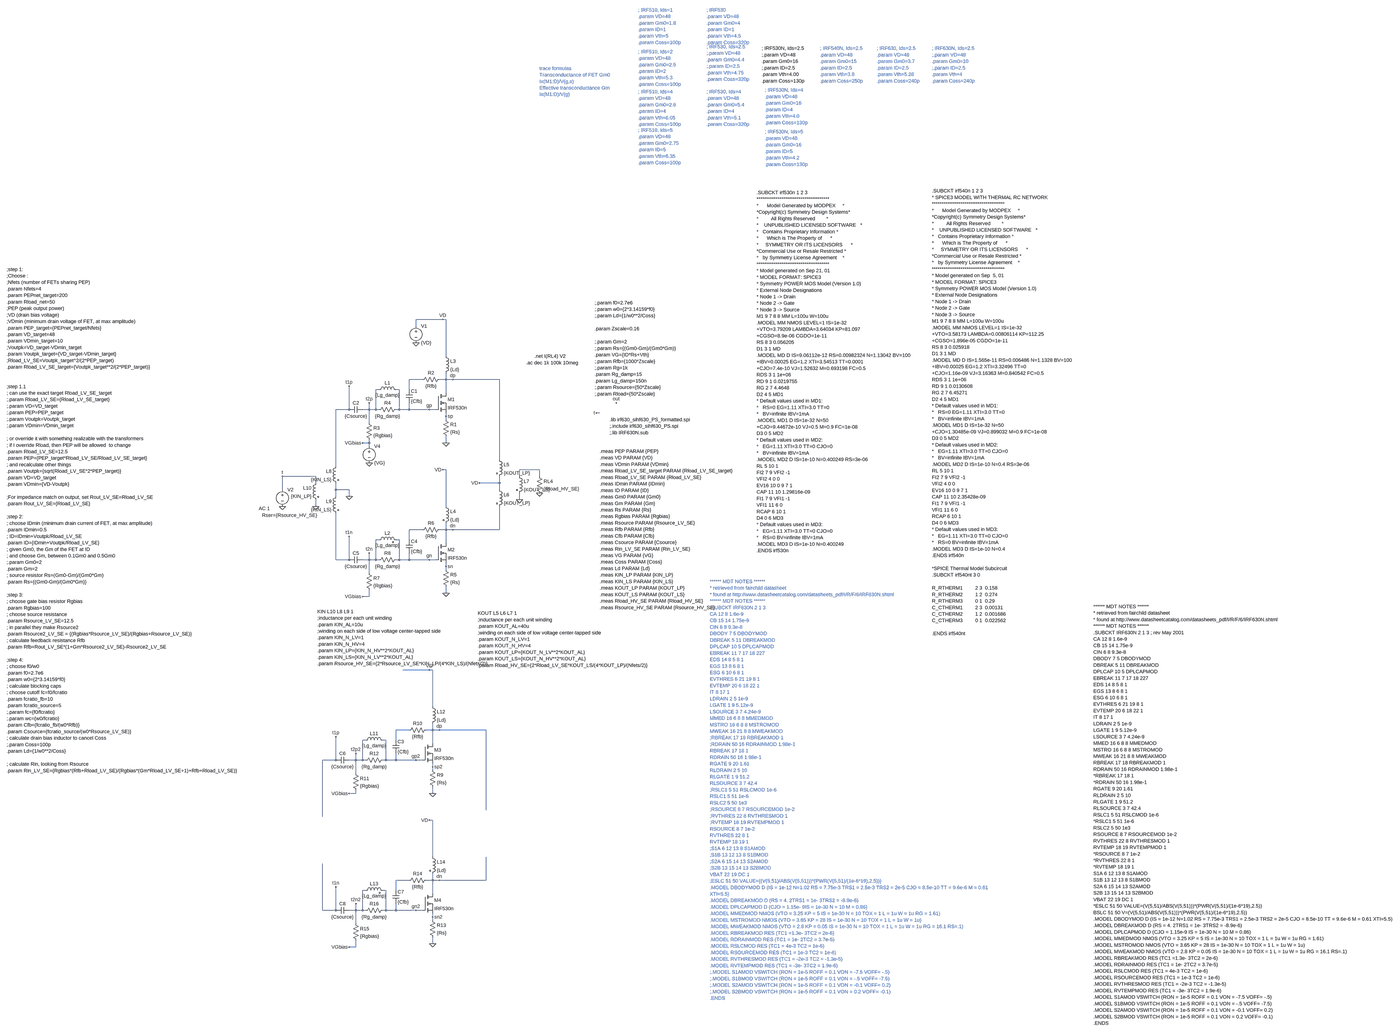
[diagram p0: schematic RFPA_pushpullx2_smallsignal_param.asc, whole sheet]
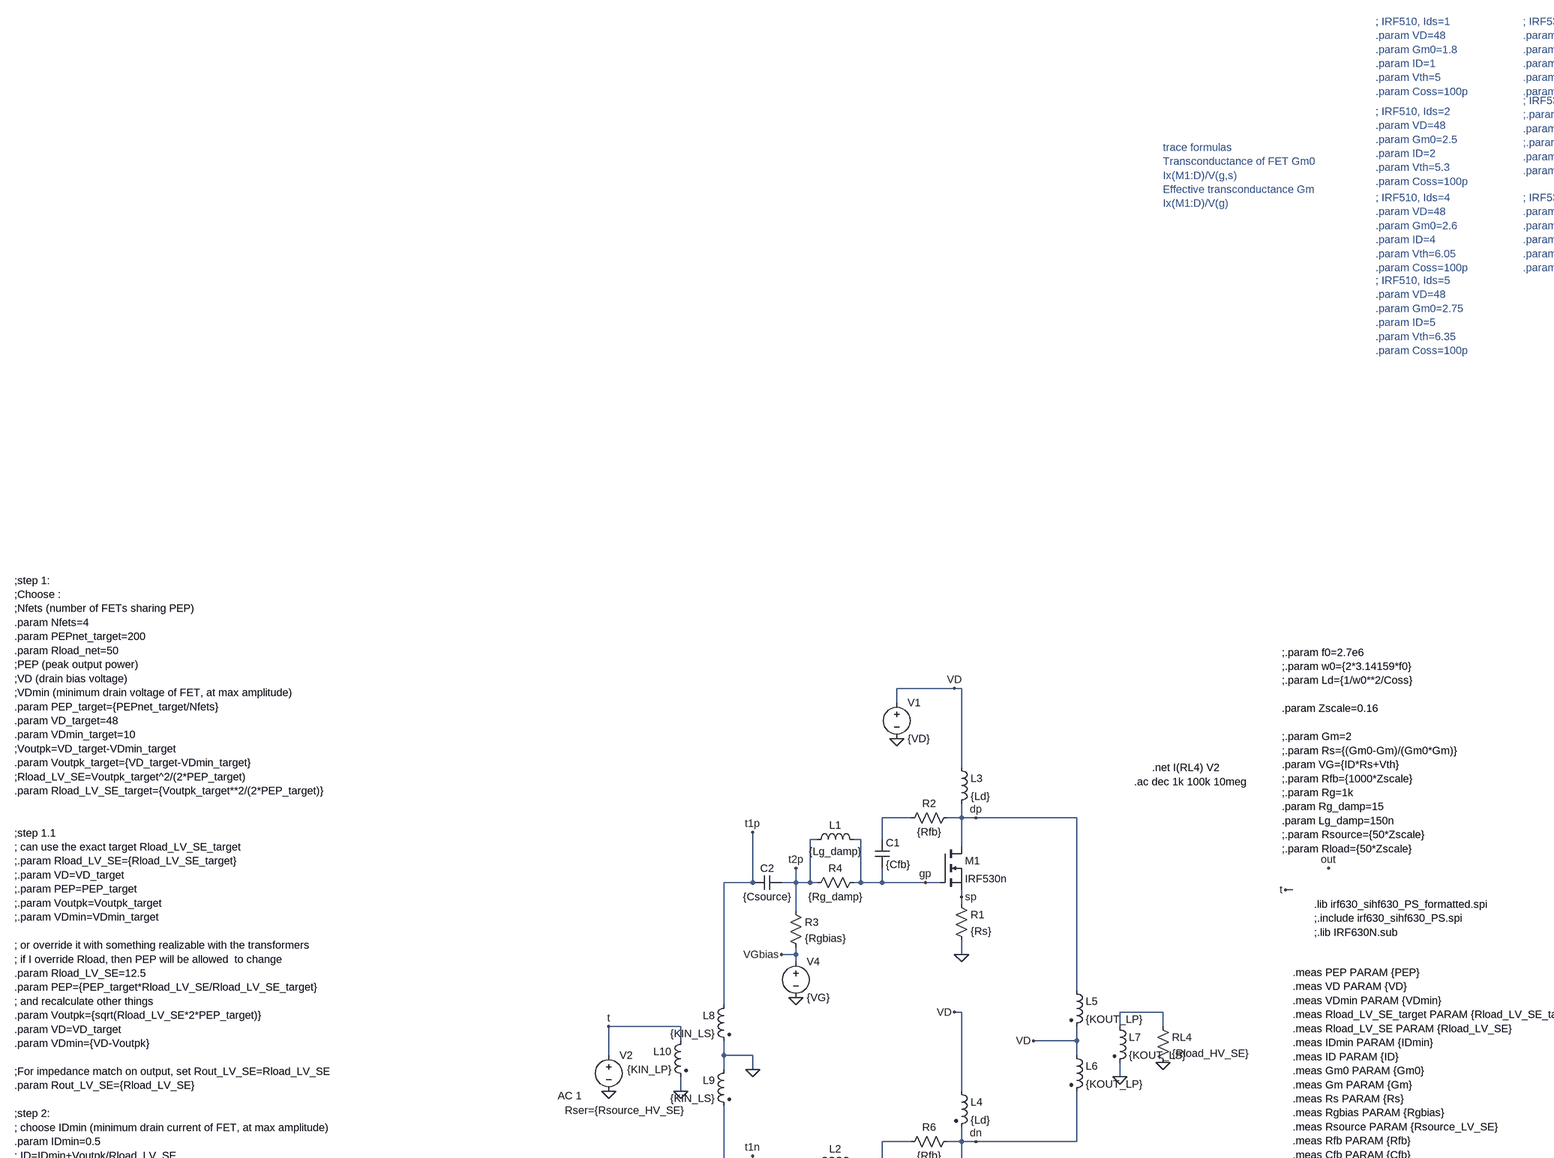
[diagram p1: schematic RFPA_pushpullx2_smallsignal_param.asc, part, row 1 of 2, column 1 of 2]
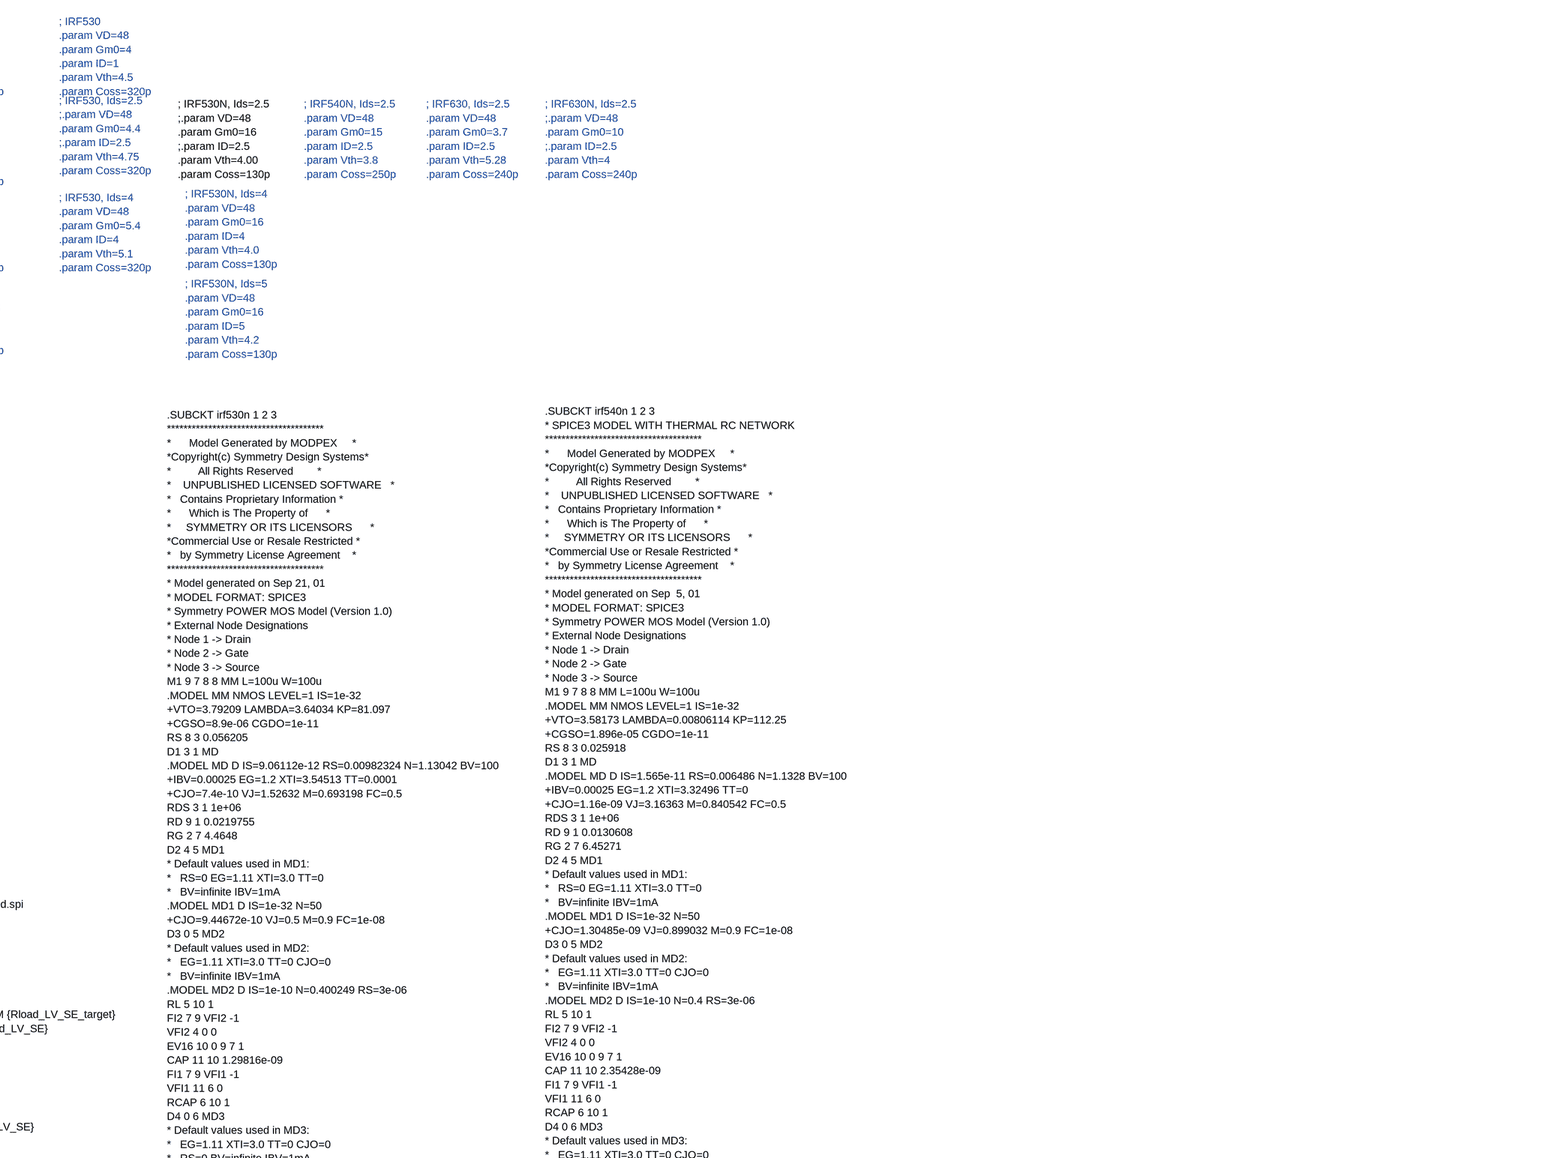
[diagram p2: schematic RFPA_pushpullx2_smallsignal_param.asc, part, row 1 of 2, column 2 of 2]
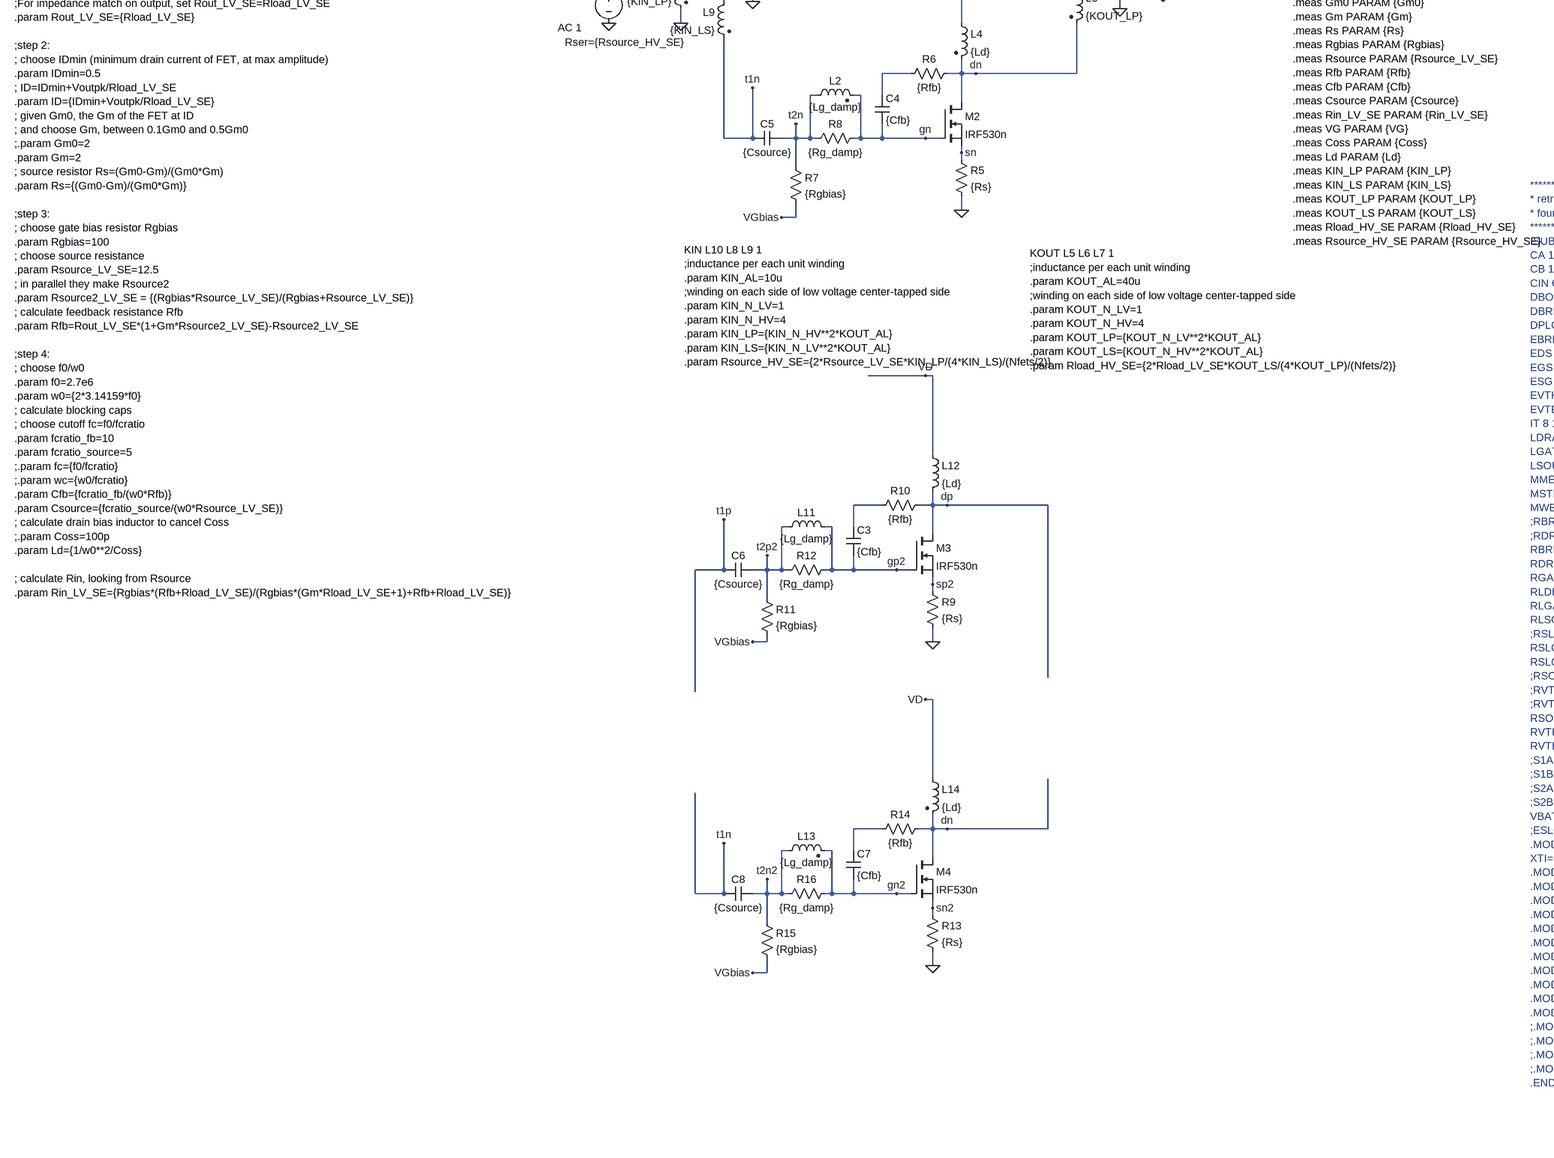
[diagram p3: schematic RFPA_pushpullx2_smallsignal_param.asc, part, row 2 of 2, column 1 of 2]
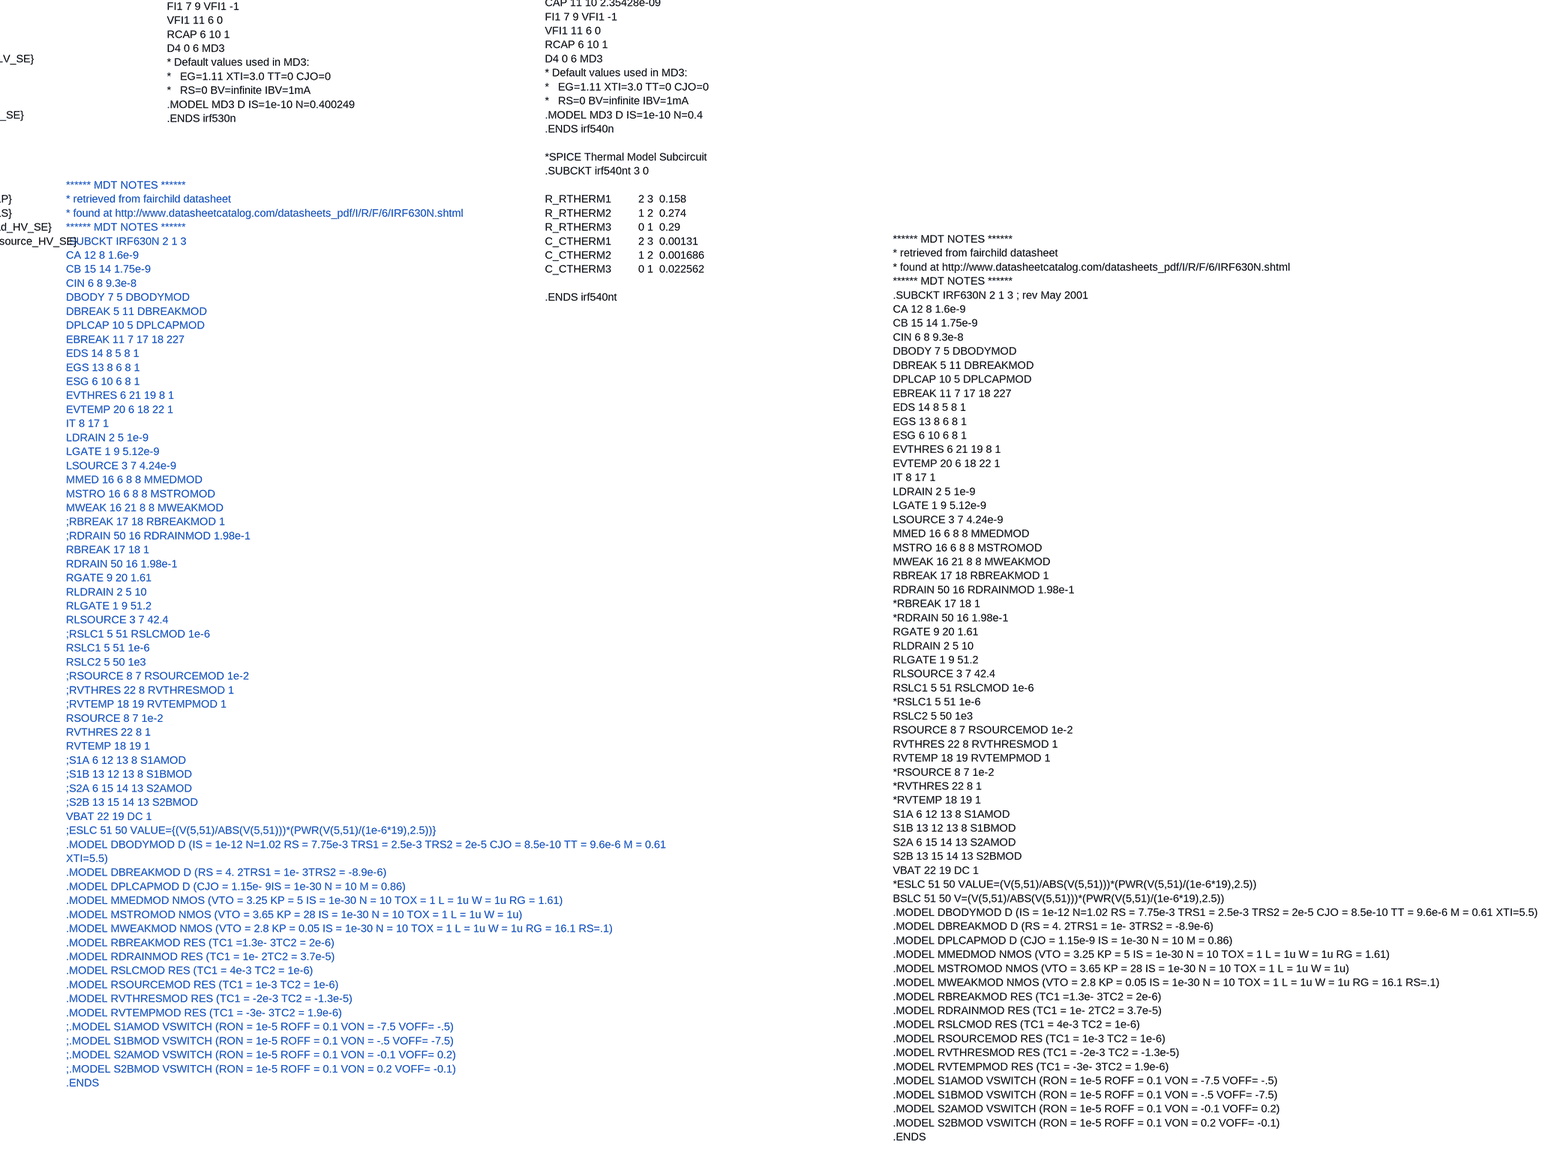
[diagram p4: schematic RFPA_pushpullx2_smallsignal_param.asc, part, row 2 of 2, column 2 of 2]
RFPA_pushpullx2_smallsignal_param.asc, the LTspice schematic file:
Version 4
SHEET 1 5344 3112
WIRE 176 -368 48 -368
WIRE 192 -368 176 -368
WIRE 48 -336 48 -368
WIRE 192 -192 192 -368
WIRE 80 -80 16 -80
WIRE 192 -80 192 -112
WIRE 192 -80 160 -80
WIRE 224 -80 192 -80
WIRE 448 -80 224 -80
WIRE -128 -32 -144 -32
WIRE -32 -32 -48 -32
WIRE 16 -32 16 -80
WIRE 192 -16 192 -80
WIRE -272 64 -272 -48
WIRE -272 64 -336 64
WIRE -176 64 -176 32
WIRE -176 64 -208 64
WIRE -144 64 -144 -32
WIRE -144 64 -176 64
WIRE -128 64 -144 64
WIRE -32 64 -32 -32
WIRE -32 64 -48 64
WIRE 16 64 16 32
WIRE 16 64 -32 64
WIRE 112 64 16 64
WIRE 144 64 112 64
WIRE 928 80 912 80
WIRE 192 96 192 80
WIRE 192 112 192 96
WIRE -176 128 -176 64
WIRE -176 224 -176 208
WIRE -176 224 -208 224
WIRE 192 224 192 192
WIRE -176 240 -176 224
WIRE 448 304 448 -80
WIRE -336 336 -336 64
WIRE 192 352 176 352
WIRE 640 352 544 352
WIRE -432 384 -592 384
WIRE 544 384 544 352
WIRE 640 384 640 352
WIRE -432 416 -432 384
WIRE 448 416 448 384
WIRE 448 416 352 416
WIRE -592 448 -592 384
WIRE -336 448 -336 416
WIRE -272 448 -336 448
WIRE 448 448 448 416
WIRE -336 480 -336 448
WIRE -272 480 -272 448
WIRE 544 496 544 464
WIRE -432 528 -432 496
WIRE 192 528 192 352
WIRE 80 640 16 640
WIRE 192 640 192 608
WIRE 192 640 160 640
WIRE 224 640 192 640
WIRE 448 640 448 528
WIRE 448 640 224 640
WIRE -128 688 -144 688
WIRE -32 688 -48 688
WIRE 16 688 16 640
WIRE 192 704 192 640
WIRE -336 784 -336 560
WIRE -272 784 -272 672
WIRE -272 784 -336 784
WIRE -176 784 -176 752
WIRE -176 784 -208 784
WIRE -144 784 -144 688
WIRE -144 784 -176 784
WIRE -128 784 -144 784
WIRE -32 784 -32 688
WIRE -32 784 -48 784
WIRE 16 784 16 752
WIRE 16 784 -32 784
WIRE 112 784 16 784
WIRE 144 784 112 784
WIRE 192 816 192 800
WIRE 192 832 192 816
WIRE -176 848 -176 784
WIRE 192 944 192 912
WIRE -176 960 -176 928
WIRE -176 960 -208 960
WIRE 112 1312 -16 1312
WIRE 128 1312 112 1312
WIRE 128 1488 128 1312
WIRE 16 1600 -48 1600
WIRE 128 1600 128 1568
WIRE 128 1600 96 1600
WIRE 160 1600 128 1600
WIRE 384 1600 160 1600
WIRE -192 1648 -208 1648
WIRE -96 1648 -112 1648
WIRE -48 1648 -48 1600
WIRE 128 1664 128 1600
WIRE -336 1744 -336 1632
WIRE -336 1744 -400 1744
WIRE -240 1744 -240 1712
WIRE -240 1744 -272 1744
WIRE -208 1744 -208 1648
WIRE -208 1744 -240 1744
WIRE -192 1744 -208 1744
WIRE -96 1744 -96 1648
WIRE -96 1744 -112 1744
WIRE -48 1744 -48 1712
WIRE -48 1744 -96 1744
WIRE 48 1744 -48 1744
WIRE 80 1744 48 1744
WIRE 128 1776 128 1760
WIRE 128 1792 128 1776
WIRE -240 1808 -240 1744
WIRE -240 1904 -240 1888
WIRE -240 1904 -272 1904
WIRE 128 1904 128 1872
WIRE 384 1984 384 1600
WIRE -400 2016 -400 1744
WIRE 128 2032 112 2032
WIRE 128 2208 128 2032
WIRE 16 2320 -48 2320
WIRE 128 2320 128 2288
WIRE 128 2320 96 2320
WIRE 160 2320 128 2320
WIRE 384 2320 384 2208
WIRE 384 2320 160 2320
WIRE -192 2368 -208 2368
WIRE -96 2368 -112 2368
WIRE -48 2368 -48 2320
WIRE 128 2384 128 2320
WIRE -400 2464 -400 2240
WIRE -336 2464 -336 2352
WIRE -336 2464 -400 2464
WIRE -240 2464 -240 2432
WIRE -240 2464 -272 2464
WIRE -208 2464 -208 2368
WIRE -208 2464 -240 2464
WIRE -192 2464 -208 2464
WIRE -96 2464 -96 2368
WIRE -96 2464 -112 2464
WIRE -48 2464 -48 2432
WIRE -48 2464 -96 2464
WIRE 48 2464 -48 2464
WIRE 80 2464 48 2464
WIRE 128 2496 128 2480
WIRE 128 2512 128 2496
WIRE -240 2528 -240 2464
WIRE 128 2624 128 2592
WIRE -240 2640 -240 2608
WIRE -240 2640 -272 2640
FLAG 192 224 0
FLAG -592 528 0
FLAG -176 320 0
FLAG 48 -256 0
FLAG 224 -80 dp
FLAG 112 64 gp
FLAG 192 96 sp
FLAG -592 384 t
FLAG 1008 32 out
FLAG -272 -48 t1p
FLAG 912 80 t
FLAG -176 32 t2p
FLAG 192 944 0
FLAG 224 640 dn
FLAG 112 784 gn
FLAG 192 816 sn
FLAG -272 672 t1n
FLAG -176 752 t2n
FLAG 176 -368 VD
FLAG 176 352 VD
FLAG -208 224 VGbias
FLAG -208 960 VGbias
FLAG 640 464 0
FLAG 544 496 0
FLAG -432 528 0
FLAG -272 480 0
FLAG 352 416 VD
FLAG 128 1904 0
FLAG 160 1600 dp
FLAG 48 1744 gp2
FLAG 128 1776 sp2
FLAG -336 1632 t1p
FLAG -240 1712 t2p2
FLAG 128 2624 0
FLAG 160 2320 dn
FLAG 48 2464 gn2
FLAG 128 2496 sn2
FLAG -336 2352 t1n
FLAG -240 2432 t2n2
FLAG 112 1312 VD
FLAG 112 2032 VD
FLAG -272 1904 VGbias
FLAG -272 2640 VGbias
SYMBOL nmos 144 -16 R0
SYMATTR InstName M1
SYMATTR Value IRF530n
SYMATTR Prefix X
SYMBOL res 176 96 R0
SYMATTR InstName R1
SYMATTR Value {Rs}
SYMBOL res 176 -96 R90
WINDOW 0 0 56 VBottom 2
WINDOW 3 32 56 VTop 2
SYMATTR InstName R2
SYMATTR Value {Rfb}
SYMBOL cap 0 -32 R0
SYMATTR InstName C1
SYMATTR Value {Cfb}
SYMBOL res -192 112 R0
SYMATTR InstName R3
SYMATTR Value {Rgbias}
SYMBOL res -32 48 R90
WINDOW 0 0 56 VBottom 2
WINDOW 3 32 56 VTop 2
SYMATTR InstName R4
SYMATTR Value {Rg_damp}
SYMBOL ind -144 -16 R270
WINDOW 0 32 56 VTop 2
WINDOW 3 5 56 VBottom 2
SYMATTR InstName L1
SYMATTR Value {Lg_damp}
SYMBOL cap -208 48 R90
WINDOW 0 0 32 VBottom 2
WINDOW 3 32 32 VTop 2
SYMATTR InstName C2
SYMATTR Value {Csource}
SYMBOL voltage 48 -352 R0
WINDOW 123 0 0 Left 0
WINDOW 39 0 0 Left 0
SYMATTR InstName V1
SYMATTR Value {VD}
SYMBOL voltage -592 432 R0
WINDOW 123 -113 106 Left 2
WINDOW 39 -97 139 Left 2
SYMATTR Value2 AC 1
SYMATTR SpiceLine Rser={Rsource_HV_SE}
SYMATTR InstName V2
SYMATTR Value ""
SYMBOL voltage -176 224 R0
WINDOW 123 0 0 Left 0
WINDOW 39 0 0 Left 0
SYMATTR InstName V4
SYMATTR Value {VG}
SYMBOL ind 176 -208 R0
SYMATTR InstName L3
SYMATTR Value {Ld}
SYMBOL nmos 144 704 R0
SYMATTR InstName M2
SYMATTR Value IRF530n
SYMATTR Prefix X
SYMBOL res 176 816 R0
SYMATTR InstName R5
SYMATTR Value {Rs}
SYMBOL res 176 624 R90
WINDOW 0 0 56 VBottom 2
WINDOW 3 32 56 VTop 2
SYMATTR InstName R6
SYMATTR Value {Rfb}
SYMBOL cap 0 688 R0
SYMATTR InstName C4
SYMATTR Value {Cfb}
SYMBOL res -192 832 R0
SYMATTR InstName R7
SYMATTR Value {Rgbias}
SYMBOL res -32 768 R90
WINDOW 0 0 56 VBottom 2
WINDOW 3 32 56 VTop 2
SYMATTR InstName R8
SYMATTR Value {Rg_damp}
SYMBOL ind2 -144 704 R270
WINDOW 0 32 56 VTop 2
WINDOW 3 5 56 VBottom 2
SYMATTR InstName L2
SYMATTR Value {Lg_damp}
SYMATTR Type ind
SYMBOL cap -208 768 R90
WINDOW 0 0 32 VBottom 2
WINDOW 3 32 32 VTop 2
SYMATTR InstName C5
SYMATTR Value {Csource}
SYMBOL ind2 176 512 R0
SYMATTR InstName L4
SYMATTR Value {Ld}
SYMATTR Type ind
SYMBOL ind2 432 288 R0
SYMATTR InstName L5
SYMATTR Value {KOUT_LP}
SYMATTR Type ind
SYMBOL ind2 432 432 R0
SYMATTR InstName L6
SYMATTR Value {KOUT_LP}
SYMATTR Type ind
SYMBOL ind2 528 368 R0
SYMATTR InstName L7
SYMATTR Value {KOUT_LS}
SYMATTR Type ind
SYMBOL res 624 368 R0
SYMATTR InstName RL4
SYMATTR Value {Rload_HV_SE}
SYMBOL ind2 -320 320 M0
SYMATTR InstName L8
SYMATTR Value {KIN_LS}
SYMATTR Type ind
SYMBOL ind2 -320 464 M0
SYMATTR InstName L9
SYMATTR Value {KIN_LS}
SYMATTR Type ind
SYMBOL ind2 -416 400 M0
SYMATTR InstName L10
SYMATTR Value {KIN_LP}
SYMATTR Type ind
SYMBOL nmos 80 1664 R0
SYMATTR InstName M3
SYMATTR Value IRF530n
SYMATTR Prefix X
SYMBOL res 112 1776 R0
SYMATTR InstName R9
SYMATTR Value {Rs}
SYMBOL res 112 1584 R90
WINDOW 0 0 56 VBottom 2
WINDOW 3 32 56 VTop 2
SYMATTR InstName R10
SYMATTR Value {Rfb}
SYMBOL cap -64 1648 R0
SYMATTR InstName C3
SYMATTR Value {Cfb}
SYMBOL res -256 1792 R0
SYMATTR InstName R11
SYMATTR Value {Rgbias}
SYMBOL res -96 1728 R90
WINDOW 0 0 56 VBottom 2
WINDOW 3 32 56 VTop 2
SYMATTR InstName R12
SYMATTR Value {Rg_damp}
SYMBOL ind -208 1664 R270
WINDOW 0 32 56 VTop 2
WINDOW 3 5 56 VBottom 2
SYMATTR InstName L11
SYMATTR Value {Lg_damp}
SYMBOL cap -272 1728 R90
WINDOW 0 0 32 VBottom 2
WINDOW 3 32 32 VTop 2
SYMATTR InstName C6
SYMATTR Value {Csource}
SYMBOL ind 112 1472 R0
SYMATTR InstName L12
SYMATTR Value {Ld}
SYMBOL nmos 80 2384 R0
SYMATTR InstName M4
SYMATTR Value IRF530n
SYMATTR Prefix X
SYMBOL res 112 2496 R0
SYMATTR InstName R13
SYMATTR Value {Rs}
SYMBOL res 112 2304 R90
WINDOW 0 0 56 VBottom 2
WINDOW 3 32 56 VTop 2
SYMATTR InstName R14
SYMATTR Value {Rfb}
SYMBOL cap -64 2368 R0
SYMATTR InstName C7
SYMATTR Value {Cfb}
SYMBOL res -256 2512 R0
SYMATTR InstName R15
SYMATTR Value {Rgbias}
SYMBOL res -96 2448 R90
WINDOW 0 0 56 VBottom 2
WINDOW 3 32 56 VTop 2
SYMATTR InstName R16
SYMATTR Value {Rg_damp}
SYMBOL ind2 -208 2384 R270
WINDOW 0 32 56 VTop 2
WINDOW 3 5 56 VBottom 2
SYMATTR InstName L13
SYMATTR Value {Lg_damp}
SYMATTR Type ind
SYMBOL cap -272 2448 R90
WINDOW 0 0 32 VBottom 2
WINDOW 3 32 32 VTop 2
SYMATTR InstName C8
SYMATTR Value {Csource}
SYMBOL ind2 112 2192 R0
SYMATTR InstName L14
SYMATTR Value {Ld}
SYMATTR Type ind
TEXT 904 -448 Left 2 !;.param f0=2.7e6\n;.param w0={2*3.14159*f0}\n;.param Ld={1/w0**2/Coss}\n \n.param Zscale=0.16\n \n;.param Gm=2\n;.param Rs={(Gm0-Gm)/(Gm0*Gm)}\n.param VG={ID*Rs+Vth}\n;.param Rfb={1000*Zscale}\n;.param Rg=1k\n.param Rg_damp=15\n.param Lg_damp=150n\n;.param Rsource={50*Zscale}\n;.param Rload={50*Zscale}
TEXT 616 -192 Left 2 !.net I(RL4) V2
TEXT 576 -160 Left 2 !.ac dec 1k 100k 10meg
TEXT 1440 -1968 Left 2 ;; IRF530\n.param VD=48\n.param Gm0=4\n.param ID=1\n.param Vth=4.5\n.param Coss=320p
TEXT 1112 -1968 Left 2 ;; IRF510, Ids=1\n.param VD=48\n.param Gm0=1.8\n.param ID=1\n.param Vth=5\n.param Coss=100p
TEXT 1112 -1768 Left 2 ;; IRF510, Ids=2\n.param VD=48\n.param Gm0=2.5\n.param ID=2\n.param Vth=5.3\n.param Coss=100p
TEXT 1112 -1576 Left 2 ;; IRF510, Ids=4\n.param VD=48\n.param Gm0=2.6\n.param ID=4\n.param Vth=6.05\n.param Coss=100p
TEXT 1112 -1392 Left 2 ;; IRF510, Ids=5\n.param VD=48\n.param Gm0=2.75\n.param ID=5\n.param Vth=6.35\n.param Coss=100p
TEXT 1440 -1792 Left 2 ;; IRF530, Ids=2.5\n;.param VD=48\n.param Gm0=4.4\n;.param ID=2.5\n.param Vth=4.75\n.param Coss=320p
TEXT 1440 -1576 Left 2 ;; IRF530, Ids=4\n.param VD=48\n.param Gm0=5.4\n.param ID=4\n.param Vth=5.1\n.param Coss=320p
TEXT 1680 -976 Left 2 !.SUBCKT irf530n 1 2 3\n**************************************\n*      Model Generated by MODPEX     *\n*Copyright(c) Symmetry Design Systems*\n*         All Rights Reserved        *\n*    UNPUBLISHED LICENSED SOFTWARE   *\n*   Contains Proprietary Information *\n*      Which is The Property of      *\n*     SYMMETRY OR ITS LICENSORS      *\n*Commercial Use or Resale Restricted *\n*   by Symmetry License Agreement    *\n**************************************\n* Model generated on Sep 21, 01\n* MODEL FORMAT: SPICE3\n* Symmetry POWER MOS Model (Version 1.0)\n* External Node Designations\n* Node 1 -> Drain\n* Node 2 -> Gate\n* Node 3 -> Source\nM1 9 7 8 8 MM L=100u W=100u\n.MODEL MM NMOS LEVEL=1 IS=1e-32\n+VTO=3.79209 LAMBDA=3.64034 KP=81.097\n+CGSO=8.9e-06 CGDO=1e-11\nRS 8 3 0.056205\nD1 3 1 MD\n.MODEL MD D IS=9.06112e-12 RS=0.00982324 N=1.13042 BV=100\n+IBV=0.00025 EG=1.2 XTI=3.54513 TT=0.0001\n+CJO=7.4e-10 VJ=1.52632 M=0.693198 FC=0.5\nRDS 3 1 1e+06\nRD 9 1 0.0219755\nRG 2 7 4.4648\nD2 4 5 MD1\n* Default values used in MD1:\n*   RS=0 EG=1.11 XTI=3.0 TT=0\n*   BV=infinite IBV=1mA\n.MODEL MD1 D IS=1e-32 N=50\n+CJO=9.44672e-10 VJ=0.5 M=0.9 FC=1e-08\nD3 0 5 MD2\n* Default values used in MD2:\n*   EG=1.11 XTI=3.0 TT=0 CJO=0\n*   BV=infinite IBV=1mA\n.MODEL MD2 D IS=1e-10 N=0.400249 RS=3e-06\nRL 5 10 1\nFI2 7 9 VFI2 -1\nVFI2 4 0 0\nEV16 10 0 9 7 1\nCAP 11 10 1.29816e-09\nFI1 7 9 VFI1 -1\nVFI1 11 6 0\nRCAP 6 10 1\nD4 0 6 MD3\n* Default values used in MD3:\n*   EG=1.11 XTI=3.0 TT=0 CJO=0\n*   RS=0 BV=infinite IBV=1mA\n.MODEL MD3 D IS=1e-10 N=0.400249\n.ENDS irf530n
TEXT 1720 -1584 Left 2 ;; IRF530N, Ids=4\n.param VD=48\n.param Gm0=16\n.param ID=4\n.param Vth=4.0\n.param Coss=130p
TEXT 1720 -1384 Left 2 ;; IRF530N, Ids=5\n.param VD=48\n.param Gm0=16\n.param ID=5\n.param Vth=4.2\n.param Coss=130p
TEXT 1704 -1784 Left 2 !; IRF530N, Ids=2.5\n;.param VD=48\n.param Gm0=16\n;.param ID=2.5\n.param Vth=4.00\n.param Coss=130p
TEXT 2520 -984 Left 2 !.SUBCKT irf540n 1 2 3\n* SPICE3 MODEL WITH THERMAL RC NETWORK\n**************************************\n*      Model Generated by MODPEX     *\n*Copyright(c) Symmetry Design Systems*\n*         All Rights Reserved        *\n*    UNPUBLISHED LICENSED SOFTWARE   *\n*   Contains Proprietary Information *\n*      Which is The Property of      *\n*     SYMMETRY OR ITS LICENSORS      *\n*Commercial Use or Resale Restricted *\n*   by Symmetry License Agreement    *\n**************************************\n* Model generated on Sep  5, 01\n* MODEL FORMAT: SPICE3\n* Symmetry POWER MOS Model (Version 1.0)\n* External Node Designations\n* Node 1 -> Drain\n* Node 2 -> Gate\n* Node 3 -> Source\nM1 9 7 8 8 MM L=100u W=100u\n.MODEL MM NMOS LEVEL=1 IS=1e-32\n+VTO=3.58173 LAMBDA=0.00806114 KP=112.25\n+CGSO=1.896e-05 CGDO=1e-11\nRS 8 3 0.025918\nD1 3 1 MD\n.MODEL MD D IS=1.565e-11 RS=0.006486 N=1.1328 BV=100\n+IBV=0.00025 EG=1.2 XTI=3.32496 TT=0\n+CJO=1.16e-09 VJ=3.16363 M=0.840542 FC=0.5\nRDS 3 1 1e+06\nRD 9 1 0.0130608\nRG 2 7 6.45271\nD2 4 5 MD1\n* Default values used in MD1:\n*   RS=0 EG=1.11 XTI=3.0 TT=0\n*   BV=infinite IBV=1mA\n.MODEL MD1 D IS=1e-32 N=50\n+CJO=1.30485e-09 VJ=0.899032 M=0.9 FC=1e-08\nD3 0 5 MD2\n* Default values used in MD2:\n*   EG=1.11 XTI=3.0 TT=0 CJO=0\n*   BV=infinite IBV=1mA\n.MODEL MD2 D IS=1e-10 N=0.4 RS=3e-06\nRL 5 10 1\nFI2 7 9 VFI2 -1\nVFI2 4 0 0\nEV16 10 0 9 7 1\nCAP 11 10 2.35428e-09\nFI1 7 9 VFI1 -1\nVFI1 11 6 0\nRCAP 6 10 1\nD4 0 6 MD3\n* Default values used in MD3:\n*   EG=1.11 XTI=3.0 TT=0 CJO=0\n*   RS=0 BV=infinite IBV=1mA\n.MODEL MD3 D IS=1e-10 N=0.4\n.ENDS irf540n\n \n*SPICE Thermal Model Subcircuit\n.SUBCKT irf540nt 3 0\n \nR_RTHERM1         2 3  0.158\nR_RTHERM2         1 2  0.274\nR_RTHERM3         0 1  0.29\nC_CTHERM1         2 3  0.00131\nC_CTHERM2         1 2  0.001686\nC_CTHERM3         0 1  0.022562\n \n.ENDS irf540nt
TEXT 1984 -1784 Left 2 ;; IRF540N, Ids=2.5\n.param VD=48\n.param Gm0=15\n.param ID=2.5\n.param Vth=3.8\n.param Coss=250p
TEXT 976 112 Left 2 !.lib irf630_sihf630_PS_formatted.spi\n;.include irf630_sihf630_PS.spi\n;.lib IRF630N.sub
TEXT 2256 -1784 Left 2 ;; IRF630, Ids=2.5\n.param VD=48\n.param Gm0=3.7\n.param ID=2.5\n.param Vth=5.28\n.param Coss=240p
TEXT 640 -1688 Left 2 ;trace formulas\nTransconductance of FET Gm0\nIx(M1:D)/V(g,s)\nEffective transconductance Gm\nIx(M1:D)/V(g)
TEXT 1456 888 Left 2 ;****** MDT NOTES ******\n* retrieved from fairchild datasheet\n* found at http://www.datasheetcatalog.com/datasheets_pdf/I/R/F/6/IRF630N.shtml\n****** MDT NOTES ******\n.SUBCKT IRF630N 2 1 3\nCA 12 8 1.6e-9\nCB 15 14 1.75e-9\nCIN 6 8 9.3e-8\nDBODY 7 5 DBODYMOD\nDBREAK 5 11 DBREAKMOD\nDPLCAP 10 5 DPLCAPMOD\nEBREAK 11 7 17 18 227\nEDS 14 8 5 8 1\nEGS 13 8 6 8 1\nESG 6 10 6 8 1\nEVTHRES 6 21 19 8 1\nEVTEMP 20 6 18 22 1\nIT 8 17 1\nLDRAIN 2 5 1e-9\nLGATE 1 9 5.12e-9\nLSOURCE 3 7 4.24e-9\nMMED 16 6 8 8 MMEDMOD\nMSTRO 16 6 8 8 MSTROMOD\nMWEAK 16 21 8 8 MWEAKMOD\n;RBREAK 17 18 RBREAKMOD 1\n;RDRAIN 50 16 RDRAINMOD 1.98e-1\nRBREAK 17 18 1\nRDRAIN 50 16 1.98e-1\nRGATE 9 20 1.61\nRLDRAIN 2 5 10\nRLGATE 1 9 51.2\nRLSOURCE 3 7 42.4\n;RSLC1 5 51 RSLCMOD 1e-6\nRSLC1 5 51 1e-6\nRSLC2 5 50 1e3\n;RSOURCE 8 7 RSOURCEMOD 1e-2\n;RVTHRES 22 8 RVTHRESMOD 1\n;RVTEMP 18 19 RVTEMPMOD 1\nRSOURCE 8 7 1e-2\nRVTHRES 22 8 1\nRVTEMP 18 19 1\n;S1A 6 12 13 8 S1AMOD\n;S1B 13 12 13 8 S1BMOD\n;S2A 6 15 14 13 S2AMOD\n;S2B 13 15 14 13 S2BMOD\nVBAT 22 19 DC 1\n;ESLC 51 50 VALUE={(V(5,51)/ABS(V(5,51)))*(PWR(V(5,51)/(1e-6*19),2.5))}\n.MODEL DBODYMOD D (IS = 1e-12 N=1.02 RS = 7.75e-3 TRS1 = 2.5e-3 TRS2 = 2e-5 CJO = 8.5e-10 TT = 9.6e-6 M = 0.61\nXTI=5.5)\n.MODEL DBREAKMOD D (RS = 4. 2TRS1 = 1e- 3TRS2 = -8.9e-6)\n.MODEL DPLCAPMOD D (CJO = 1.15e- 9IS = 1e-30 N = 10 M = 0.86)\n.MODEL MMEDMOD NMOS (VTO = 3.25 KP = 5 IS = 1e-30 N = 10 TOX = 1 L = 1u W = 1u RG = 1.61)\n.MODEL MSTROMOD NMOS (VTO = 3.65 KP = 28 IS = 1e-30 N = 10 TOX = 1 L = 1u W = 1u)\n.MODEL MWEAKMOD NMOS (VTO = 2.8 KP = 0.05 IS = 1e-30 N = 10 TOX = 1 L = 1u W = 1u RG = 16.1 RS=.1)\n.MODEL RBREAKMOD RES (TC1 =1.3e- 3TC2 = 2e-6)\n.MODEL RDRAINMOD RES (TC1 = 1e- 2TC2 = 3.7e-5)\n.MODEL RSLCMOD RES (TC1 = 4e-3 TC2 = 1e-6)\n.MODEL RSOURCEMOD RES (TC1 = 1e-3 TC2 = 1e-6)\n.MODEL RVTHRESMOD RES (TC1 = -2e-3 TC2 = -1.3e-5)\n.MODEL RVTEMPMOD RES (TC1 = -3e- 3TC2 = 1.9e-6)\n;.MODEL S1AMOD VSWITCH (RON = 1e-5 ROFF = 0.1 VON = -7.5 VOFF= -.5)\n;.MODEL S1BMOD VSWITCH (RON = 1e-5 ROFF = 0.1 VON = -.5 VOFF= -7.5)\n;.MODEL S2AMOD VSWITCH (RON = 1e-5 ROFF = 0.1 VON = -0.1 VOFF= 0.2)\n;.MODEL S2BMOD VSWITCH (RON = 1e-5 ROFF = 0.1 VON = 0.2 VOFF= -0.1)\n.ENDS
TEXT 3448 1008 Left 2 !****** MDT NOTES ******\n* retrieved from fairchild datasheet\n* found at http://www.datasheetcatalog.com/datasheets_pdf/I/R/F/6/IRF630N.shtml\n****** MDT NOTES ******\n.SUBCKT IRF630N 2 1 3 ; rev May 2001\nCA 12 8 1.6e-9\nCB 15 14 1.75e-9\nCIN 6 8 9.3e-8\nDBODY 7 5 DBODYMOD\nDBREAK 5 11 DBREAKMOD\nDPLCAP 10 5 DPLCAPMOD\nEBREAK 11 7 17 18 227\nEDS 14 8 5 8 1\nEGS 13 8 6 8 1\nESG 6 10 6 8 1\nEVTHRES 6 21 19 8 1\nEVTEMP 20 6 18 22 1\nIT 8 17 1\nLDRAIN 2 5 1e-9\nLGATE 1 9 5.12e-9\nLSOURCE 3 7 4.24e-9\nMMED 16 6 8 8 MMEDMOD\nMSTRO 16 6 8 8 MSTROMOD\nMWEAK 16 21 8 8 MWEAKMOD\nRBREAK 17 18 RBREAKMOD 1\nRDRAIN 50 16 RDRAINMOD 1.98e-1\n*RBREAK 17 18 1\n*RDRAIN 50 16 1.98e-1\nRGATE 9 20 1.61\nRLDRAIN 2 5 10\nRLGATE 1 9 51.2\nRLSOURCE 3 7 42.4\nRSLC1 5 51 RSLCMOD 1e-6\n*RSLC1 5 51 1e-6\nRSLC2 5 50 1e3\nRSOURCE 8 7 RSOURCEMOD 1e-2\nRVTHRES 22 8 RVTHRESMOD 1\nRVTEMP 18 19 RVTEMPMOD 1\n*RSOURCE 8 7 1e-2\n*RVTHRES 22 8 1\n*RVTEMP 18 19 1\nS1A 6 12 13 8 S1AMOD\nS1B 13 12 13 8 S1BMOD\nS2A 6 15 14 13 S2AMOD\nS2B 13 15 14 13 S2BMOD\nVBAT 22 19 DC 1\n*ESLC 51 50 VALUE=(V(5,51)/ABS(V(5,51)))*(PWR(V(5,51)/(1e-6*19),2.5))\nBSLC 51 50 V=(V(5,51)/ABS(V(5,51)))*(PWR(V(5,51)/(1e-6*19),2.5))\n.MODEL DBODYMOD D (IS = 1e-12 N=1.02 RS = 7.75e-3 TRS1 = 2.5e-3 TRS2 = 2e-5 CJO = 8.5e-10 TT = 9.6e-6 M = 0.61 XTI=5.5)\n.MODEL DBREAKMOD D (RS = 4. 2TRS1 = 1e- 3TRS2 = -8.9e-6)\n.MODEL DPLCAPMOD D (CJO = 1.15e-9 IS = 1e-30 N = 10 M = 0.86)\n.MODEL MMEDMOD NMOS (VTO = 3.25 KP = 5 IS = 1e-30 N = 10 TOX = 1 L = 1u W = 1u RG = 1.61)\n.MODEL MSTROMOD NMOS (VTO = 3.65 KP = 28 IS = 1e-30 N = 10 TOX = 1 L = 1u W = 1u)\n.MODEL MWEAKMOD NMOS (VTO = 2.8 KP = 0.05 IS = 1e-30 N = 10 TOX = 1 L = 1u W = 1u RG = 16.1 RS=.1)\n.MODEL RBREAKMOD RES (TC1 =1.3e- 3TC2 = 2e-6)\n.MODEL RDRAINMOD RES (TC1 = 1e- 2TC2 = 3.7e-5)\n.MODEL RSLCMOD RES (TC1 = 4e-3 TC2 = 1e-6)\n.MODEL RSOURCEMOD RES (TC1 = 1e-3 TC2 = 1e-6)\n.MODEL RVTHRESMOD RES (TC1 = -2e-3 TC2 = -1.3e-5)\n.MODEL RVTEMPMOD RES (TC1 = -3e- 3TC2 = 1.9e-6)\n.MODEL S1AMOD VSWITCH (RON = 1e-5 ROFF = 0.1 VON = -7.5 VOFF= -.5)\n.MODEL S1BMOD VSWITCH (RON = 1e-5 ROFF = 0.1 VON = -.5 VOFF= -7.5)\n.MODEL S2AMOD VSWITCH (RON = 1e-5 ROFF = 0.1 VON = -0.1 VOFF= 0.2)\n.MODEL S2BMOD VSWITCH (RON = 1e-5 ROFF = 0.1 VON = 0.2 VOFF= -0.1)\n.ENDS
TEXT 2520 -1784 Left 2 ;; IRF630N, Ids=2.5\n;.param VD=48\n.param Gm0=10\n;.param ID=2.5\n.param Vth=4\n.param Coss=240p
TEXT -2256 -608 Left 2 !;step 1:\n;Choose :\n;Nfets (number of FETs sharing PEP)\n.param Nfets=4\n.param PEPnet_target=200\n.param Rload_net=50\n;PEP (peak output power) \n;VD (drain bias voltage)\n;VDmin (minimum drain voltage of FET, at max amplitude)\n.param PEP_target={PEPnet_target/Nfets}\n.param VD_target=48\n.param VDmin_target=10\n;Voutpk=VD_target-VDmin_target\n.param Voutpk_target={VD_target-VDmin_target}\n;Rload_LV_SE=Voutpk_target^2/(2*PEP_target)\n.param Rload_LV_SE_target={Voutpk_target**2/(2*PEP_target)}\n \n \n;step 1.1 \n; can use the exact target Rload_LV_SE_target\n;.param Rload_LV_SE={Rload_LV_SE_target}\n;.param VD=VD_target\n;.param PEP=PEP_target\n;.param Voutpk=Voutpk_target\n;.param VDmin=VDmin_target\n \n; or override it with something realizable with the transformers\n; if I override Rload, then PEP will be allowed  to change\n.param Rload_LV_SE=12.5\n.param PEP={PEP_target*Rload_LV_SE/Rload_LV_SE_target}\n; and recalculate other things\n.param Voutpk={sqrt(Rload_LV_SE*2*PEP_target)}\n.param VD=VD_target\n.param VDmin={VD-Voutpk}\n \n;For impedance match on output, set Rout_LV_SE=Rload_LV_SE\n.param Rout_LV_SE={Rload_LV_SE}\n \n;step 2:\n; choose IDmin (minimum drain current of FET, at max amplitude)\n.param IDmin=0.5\n; ID=IDmin+Voutpk/Rload_LV_SE\n.param ID={IDmin+Voutpk/Rload_LV_SE}\n; given Gm0, the Gm of the FET at ID\n; and choose Gm, between 0.1Gm0 and 0.5Gm0\n;.param Gm0=2\n.param Gm=2\n; source resistor Rs=(Gm0-Gm)/(Gm0*Gm)\n.param Rs={(Gm0-Gm)/(Gm0*Gm)}\n \n;step 3:\n; choose gate bias resistor Rgbias\n.param Rgbias=100\n; choose source resistance\n.param Rsource_LV_SE=12.5\n; in parallel they make Rsource2\n.param Rsource2_LV_SE = {(Rgbias*Rsource_LV_SE)/(Rgbias+Rsource_LV_SE)}\n; calculate feedback resistance Rfb\n.param Rfb=Rout_LV_SE*(1+Gm*Rsource2_LV_SE)-Rsource2_LV_SE\n \n;step 4:\n; choose f0/w0\n.param f0=2.7e6\n.param w0={2*3.14159*f0}\n; calculate blocking caps\n; choose cutoff fc=f0/fcratio\n.param fcratio_fb=10\n.param fcratio_source=5\n;.param fc={f0/fcratio}\n;.param wc={w0/fcratio}\n.param Cfb={fcratio_fb/(w0*Rfb)}\n.param Csource={fcratio_source/(w0*Rsource_LV_SE)}\n; calculate drain bias inductor to cancel Coss\n;.param Coss=100p\n.param Ld={1/w0**2/Coss}\n \n; calculate Rin, looking from Rsource\n.param Rin_LV_SE={Rgbias*(Rfb+Rload_LV_SE)/(Rgbias*(Gm*Rload_LV_SE+1)+Rfb+Rload_LV_SE)}
TEXT 928 264 Left 2 !.meas PEP PARAM {PEP}\n.meas VD PARAM {VD}\n.meas VDmin PARAM {VDmin}\n.meas Rload_LV_SE_target PARAM {Rload_LV_SE_target}\n.meas Rload_LV_SE PARAM {Rload_LV_SE}\n.meas IDmin PARAM {IDmin}\n.meas ID PARAM {ID}\n.meas Gm0 PARAM {Gm0}\n.meas Gm PARAM {Gm}\n.meas Rs PARAM {Rs}\n.meas Rgbias PARAM {Rgbias}\n.meas Rsource PARAM {Rsource_LV_SE}\n.meas Rfb PARAM {Rfb}\n.meas Cfb PARAM {Cfb}\n.meas Csource PARAM {Csource}\n.meas Rin_LV_SE PARAM {Rin_LV_SE}\n.meas VG PARAM {VG}\n.meas Coss PARAM {Coss}\n.meas Ld PARAM {Ld}\n.meas KIN_LP PARAM {KIN_LP}\n.meas KIN_LS PARAM {KIN_LS}\n.meas KOUT_LP PARAM {KOUT_LP}\n.meas KOUT_LS PARAM {KOUT_LS}\n.meas Rload_HV_SE PARAM {Rload_HV_SE}\n.meas Rsource_HV_SE PARAM {Rsource_HV_SE}
TEXT 344 1040 Left 2 !KOUT L5 L6 L7 1\n;inductance per each unit winding\n.param KOUT_AL=40u\n;winding on each side of low voltage center-tapped side\n.param KOUT_N_LV=1\n.param KOUT_N_HV=4\n.param KOUT_LP={KOUT_N_LV**2*KOUT_AL}\n.param KOUT_LS={KOUT_N_HV**2*KOUT_AL}\n.param Rload_HV_SE={2*Rload_LV_SE*KOUT_LS/(4*KOUT_LP)/(Nfets/2)}
TEXT -424 1032 Left 2 !KIN L10 L8 L9 1\n;inductance per each unit winding\n.param KIN_AL=10u\n;winding on each side of low voltage center-tapped side\n.param KIN_N_LV=1\n.param KIN_N_HV=4\n.param KIN_LP={KIN_N_HV**2*KOUT_AL}\n.param KIN_LS={KIN_N_LV**2*KOUT_AL}\n.param Rsource_HV_SE={2*Rsource_LV_SE*KIN_LP/(4*KIN_LS)/(Nfets/2)}

The netlist it stands for:
* RFPA_pushpullx2_smallsignal_param.asc
XM1 dp gp sp IRF530n  ; pins D G S
R1 sp 0 {Rs}
R2 dp N001 {Rfb}
C1 N001 gp {Cfb}
R3 t2p VGbias {Rgbias}
R4 gp t2p {Rg_damp}
L1 t2p gp {Lg_damp}
C2 t2p t1p {Csource}
V1 VD 0 {VD}
V2 t 0 AC 1 Rser={Rsource_HV_SE}
V4 VGbias 0 {VG}
L3 VD dp {Ld}
XM2 dn gn sn IRF530n  ; pins D G S
R5 sn 0 {Rs}
R6 dn N003 {Rfb}
C4 N003 gn {Cfb}
R7 t2n VGbias {Rgbias}
R8 gn t2n {Rg_damp}
L2 t2n gn {Lg_damp}
C5 t2n t1n {Csource}
L4 VD dn {Ld}
L5 dp VD {KOUT_LP}
L6 VD dn {KOUT_LP}
L7 N002 0 {KOUT_LS}
RL4 N002 0 {Rload_HV_SE}
L8 t1p 0 {KIN_LS}
L9 0 t1n {KIN_LS}
L10 t 0 {KIN_LP}
XM3 dp gp2 sp2 IRF530n  ; pins D G S
R9 sp2 0 {Rs}
R10 dp N004 {Rfb}
C3 N004 gp2 {Cfb}
R11 t2p2 VGbias {Rgbias}
R12 gp2 t2p2 {Rg_damp}
L11 t2p2 gp2 {Lg_damp}
C6 t2p2 t1p {Csource}
L12 VD dp {Ld}
XM4 dn gn2 sn2 IRF530n  ; pins D G S
R13 sn2 0 {Rs}
R14 dn N005 {Rfb}
C7 N005 gn2 {Cfb}
R15 t2n2 VGbias {Rgbias}
R16 gn2 t2n2 {Rg_damp}
L13 t2n2 gn2 {Lg_damp}
C8 t2n2 t1n {Csource}
L14 VD dn {Ld}
;.param f0=2.7e6
;.param w0={2*3.14159*f0}
;.param Ld={1/w0**2/Coss}
.param Zscale=0.16
;.param Gm=2
;.param Rs={(Gm0-Gm)/(Gm0*Gm)}
.param VG={ID*Rs+Vth}
;.param Rfb={1000*Zscale}
;.param Rg=1k
.param Rg_damp=15
.param Lg_damp=150n
;.param Rsource={50*Zscale}
;.param Rload={50*Zscale}
.net I(RL4) V2
.ac dec 1k 100k 10meg
* ; IRF530
* .param VD=48
* .param Gm0=4
* .param ID=1
* .param Vth=4.5
* .param Coss=320p
* ; IRF510, Ids=1
* .param VD=48
* .param Gm0=1.8
* .param ID=1
* .param Vth=5
* .param Coss=100p
* ; IRF510, Ids=2
* .param VD=48
* .param Gm0=2.5
* .param ID=2
* .param Vth=5.3
* .param Coss=100p
* ; IRF510, Ids=4
* .param VD=48
* .param Gm0=2.6
* .param ID=4
* .param Vth=6.05
* .param Coss=100p
* ; IRF510, Ids=5
* .param VD=48
* .param Gm0=2.75
* .param ID=5
* .param Vth=6.35
* .param Coss=100p
* ; IRF530, Ids=2.5
* ;.param VD=48
* .param Gm0=4.4
* ;.param ID=2.5
* .param Vth=4.75
* .param Coss=320p
* ; IRF530, Ids=4
* .param VD=48
* .param Gm0=5.4
* .param ID=4
* .param Vth=5.1
* .param Coss=320p
.SUBCKT irf530n 1 2 3
**************************************
*      Model Generated by MODPEX     *
*Copyright(c) Symmetry Design Systems*
*         All Rights Reserved        *
*    UNPUBLISHED LICENSED SOFTWARE   *
*   Contains Proprietary Information *
*      Which is The Property of      *
*     SYMMETRY OR ITS LICENSORS      *
*Commercial Use or Resale Restricted *
*   by Symmetry License Agreement    *
**************************************
* Model generated on Sep 21, 01
* MODEL FORMAT: SPICE3
* Symmetry POWER MOS Model (Version 1.0)
* External Node Designations
* Node 1 -> Drain
* Node 2 -> Gate
* Node 3 -> Source
M1 9 7 8 8 MM L=100u W=100u
.MODEL MM NMOS LEVEL=1 IS=1e-32
+VTO=3.79209 LAMBDA=3.64034 KP=81.097
+CGSO=8.9e-06 CGDO=1e-11
RS 8 3 0.056205
D1 3 1 MD
.MODEL MD D IS=9.06112e-12 RS=0.00982324 N=1.13042 BV=100
+IBV=0.00025 EG=1.2 XTI=3.54513 TT=0.0001
+CJO=7.4e-10 VJ=1.52632 M=0.693198 FC=0.5
RDS 3 1 1e+06
RD 9 1 0.0219755
RG 2 7 4.4648
D2 4 5 MD1
* Default values used in MD1:
*   RS=0 EG=1.11 XTI=3.0 TT=0
*   BV=infinite IBV=1mA
.MODEL MD1 D IS=1e-32 N=50
+CJO=9.44672e-10 VJ=0.5 M=0.9 FC=1e-08
D3 0 5 MD2
* Default values used in MD2:
*   EG=1.11 XTI=3.0 TT=0 CJO=0
*   BV=infinite IBV=1mA
.MODEL MD2 D IS=1e-10 N=0.400249 RS=3e-06
RL 5 10 1
FI2 7 9 VFI2 -1
VFI2 4 0 0
EV16 10 0 9 7 1
CAP 11 10 1.29816e-09
FI1 7 9 VFI1 -1
VFI1 11 6 0
RCAP 6 10 1
D4 0 6 MD3
* Default values used in MD3:
*   EG=1.11 XTI=3.0 TT=0 CJO=0
*   RS=0 BV=infinite IBV=1mA
.MODEL MD3 D IS=1e-10 N=0.400249
.ENDS irf530n
* ; IRF530N, Ids=4
* .param VD=48
* .param Gm0=16
* .param ID=4
* .param Vth=4.0
* .param Coss=130p
* ; IRF530N, Ids=5
* .param VD=48
* .param Gm0=16
* .param ID=5
* .param Vth=4.2
* .param Coss=130p
; IRF530N, Ids=2.5
;.param VD=48
.param Gm0=16
;.param ID=2.5
.param Vth=4.00
.param Coss=130p
.SUBCKT irf540n 1 2 3
* SPICE3 MODEL WITH THERMAL RC NETWORK
**************************************
*      Model Generated by MODPEX     *
*Copyright(c) Symmetry Design Systems*
*         All Rights Reserved        *
*    UNPUBLISHED LICENSED SOFTWARE   *
*   Contains Proprietary Information *
*      Which is The Property of      *
*     SYMMETRY OR ITS LICENSORS      *
*Commercial Use or Resale Restricted *
*   by Symmetry License Agreement    *
**************************************
* Model generated on Sep  5, 01
* MODEL FORMAT: SPICE3
* Symmetry POWER MOS Model (Version 1.0)
* External Node Designations
* Node 1 -> Drain
* Node 2 -> Gate
* Node 3 -> Source
M1 9 7 8 8 MM L=100u W=100u
.MODEL MM NMOS LEVEL=1 IS=1e-32
+VTO=3.58173 LAMBDA=0.00806114 KP=112.25
+CGSO=1.896e-05 CGDO=1e-11
RS 8 3 0.025918
D1 3 1 MD
.MODEL MD D IS=1.565e-11 RS=0.006486 N=1.1328 BV=100
+IBV=0.00025 EG=1.2 XTI=3.32496 TT=0
+CJO=1.16e-09 VJ=3.16363 M=0.840542 FC=0.5
RDS 3 1 1e+06
RD 9 1 0.0130608
RG 2 7 6.45271
D2 4 5 MD1
* Default values used in MD1:
*   RS=0 EG=1.11 XTI=3.0 TT=0
*   BV=infinite IBV=1mA
.MODEL MD1 D IS=1e-32 N=50
+CJO=1.30485e-09 VJ=0.899032 M=0.9 FC=1e-08
D3 0 5 MD2
* Default values used in MD2:
*   EG=1.11 XTI=3.0 TT=0 CJO=0
*   BV=infinite IBV=1mA
.MODEL MD2 D IS=1e-10 N=0.4 RS=3e-06
RL 5 10 1
FI2 7 9 VFI2 -1
VFI2 4 0 0
EV16 10 0 9 7 1
CAP 11 10 2.35428e-09
FI1 7 9 VFI1 -1
VFI1 11 6 0
RCAP 6 10 1
D4 0 6 MD3
* Default values used in MD3:
*   EG=1.11 XTI=3.0 TT=0 CJO=0
*   RS=0 BV=infinite IBV=1mA
.MODEL MD3 D IS=1e-10 N=0.4
.ENDS irf540n
*SPICE Thermal Model Subcircuit
.SUBCKT irf540nt 3 0
R_RTHERM1         2 3  0.158
R_RTHERM2         1 2  0.274
R_RTHERM3         0 1  0.29
C_CTHERM1         2 3  0.00131
C_CTHERM2         1 2  0.001686
C_CTHERM3         0 1  0.022562
.ENDS irf540nt
* ; IRF540N, Ids=2.5
* .param VD=48
* .param Gm0=15
* .param ID=2.5
* .param Vth=3.8
* .param Coss=250p
.lib irf630_sihf630_PS_formatted.spi
;.include irf630_sihf630_PS.spi
;.lib IRF630N.sub
* ; IRF630, Ids=2.5
* .param VD=48
* .param Gm0=3.7
* .param ID=2.5
* .param Vth=5.28
* .param Coss=240p
* trace formulas
* Transconductance of FET Gm0
* Ix(M1:D)/V(g,s)
* Effective transconductance Gm
* Ix(M1:D)/V(g)
* ****** MDT NOTES ******
* * retrieved from fairchild datasheet
* * found at http://www.datasheetcatalog.com/datasheets_pdf/I/R/F/6/IRF630N.shtml
* ****** MDT NOTES ******
* .SUBCKT IRF630N 2 1 3
* CA 12 8 1.6e-9
* CB 15 14 1.75e-9
* CIN 6 8 9.3e-8
* DBODY 7 5 DBODYMOD
* DBREAK 5 11 DBREAKMOD
* DPLCAP 10 5 DPLCAPMOD
* EBREAK 11 7 17 18 227
* EDS 14 8 5 8 1
* EGS 13 8 6 8 1
* ESG 6 10 6 8 1
* EVTHRES 6 21 19 8 1
* EVTEMP 20 6 18 22 1
* IT 8 17 1
* LDRAIN 2 5 1e-9
* LGATE 1 9 5.12e-9
* LSOURCE 3 7 4.24e-9
* MMED 16 6 8 8 MMEDMOD
* MSTRO 16 6 8 8 MSTROMOD
* MWEAK 16 21 8 8 MWEAKMOD
* ;RBREAK 17 18 RBREAKMOD 1
* ;RDRAIN 50 16 RDRAINMOD 1.98e-1
* RBREAK 17 18 1
* RDRAIN 50 16 1.98e-1
* RGATE 9 20 1.61
* RLDRAIN 2 5 10
* RLGATE 1 9 51.2
* RLSOURCE 3 7 42.4
* ;RSLC1 5 51 RSLCMOD 1e-6
* RSLC1 5 51 1e-6
* RSLC2 5 50 1e3
* ;RSOURCE 8 7 RSOURCEMOD 1e-2
* ;RVTHRES 22 8 RVTHRESMOD 1
* ;RVTEMP 18 19 RVTEMPMOD 1
* RSOURCE 8 7 1e-2
* RVTHRES 22 8 1
* RVTEMP 18 19 1
* ;S1A 6 12 13 8 S1AMOD
* ;S1B 13 12 13 8 S1BMOD
* ;S2A 6 15 14 13 S2AMOD
* ;S2B 13 15 14 13 S2BMOD
* VBAT 22 19 DC 1
* ;ESLC 51 50 VALUE={(V(5,51)/ABS(V(5,51)))*(PWR(V(5,51)/(1e-6*19),2.5))}
* .MODEL DBODYMOD D (IS = 1e-12 N=1.02 RS = 7.75e-3 TRS1 = 2.5e-3 TRS2 = 2e-5 CJO = 8.5e-10 TT = 9.6e-6 M = 0.61
* XTI=5.5)
* .MODEL DBREAKMOD D (RS = 4. 2TRS1 = 1e- 3TRS2 = -8.9e-6)
* .MODEL DPLCAPMOD D (CJO = 1.15e- 9IS = 1e-30 N = 10 M = 0.86)
* .MODEL MMEDMOD NMOS (VTO = 3.25 KP = 5 IS = 1e-30 N = 10 TOX = 1 L = 1u W = 1u RG = 1.61)
* .MODEL MSTROMOD NMOS (VTO = 3.65 KP = 28 IS = 1e-30 N = 10 TOX = 1 L = 1u W = 1u)
* .MODEL MWEAKMOD NMOS (VTO = 2.8 KP = 0.05 IS = 1e-30 N = 10 TOX = 1 L = 1u W = 1u RG = 16.1 RS=.1)
* .MODEL RBREAKMOD RES (TC1 =1.3e- 3TC2 = 2e-6)
* .MODEL RDRAINMOD RES (TC1 = 1e- 2TC2 = 3.7e-5)
* .MODEL RSLCMOD RES (TC1 = 4e-3 TC2 = 1e-6)
* .MODEL RSOURCEMOD RES (TC1 = 1e-3 TC2 = 1e-6)
* .MODEL RVTHRESMOD RES (TC1 = -2e-3 TC2 = -1.3e-5)
* .MODEL RVTEMPMOD RES (TC1 = -3e- 3TC2 = 1.9e-6)
* ;.MODEL S1AMOD VSWITCH (RON = 1e-5 ROFF = 0.1 VON = -7.5 VOFF= -.5)
* ;.MODEL S1BMOD VSWITCH (RON = 1e-5 ROFF = 0.1 VON = -.5 VOFF= -7.5)
* ;.MODEL S2AMOD VSWITCH (RON = 1e-5 ROFF = 0.1 VON = -0.1 VOFF= 0.2)
* ;.MODEL S2BMOD VSWITCH (RON = 1e-5 ROFF = 0.1 VON = 0.2 VOFF= -0.1)
* .ENDS
****** MDT NOTES ******
* retrieved from fairchild datasheet
* found at http://www.datasheetcatalog.com/datasheets_pdf/I/R/F/6/IRF630N.shtml
****** MDT NOTES ******
.SUBCKT IRF630N 2 1 3 ; rev May 2001
CA 12 8 1.6e-9
CB 15 14 1.75e-9
CIN 6 8 9.3e-8
DBODY 7 5 DBODYMOD
DBREAK 5 11 DBREAKMOD
DPLCAP 10 5 DPLCAPMOD
EBREAK 11 7 17 18 227
EDS 14 8 5 8 1
EGS 13 8 6 8 1
ESG 6 10 6 8 1
EVTHRES 6 21 19 8 1
EVTEMP 20 6 18 22 1
IT 8 17 1
LDRAIN 2 5 1e-9
LGATE 1 9 5.12e-9
LSOURCE 3 7 4.24e-9
MMED 16 6 8 8 MMEDMOD
MSTRO 16 6 8 8 MSTROMOD
MWEAK 16 21 8 8 MWEAKMOD
RBREAK 17 18 RBREAKMOD 1
RDRAIN 50 16 RDRAINMOD 1.98e-1
*RBREAK 17 18 1
*RDRAIN 50 16 1.98e-1
RGATE 9 20 1.61
RLDRAIN 2 5 10
RLGATE 1 9 51.2
RLSOURCE 3 7 42.4
RSLC1 5 51 RSLCMOD 1e-6
*RSLC1 5 51 1e-6
RSLC2 5 50 1e3
RSOURCE 8 7 RSOURCEMOD 1e-2
RVTHRES 22 8 RVTHRESMOD 1
RVTEMP 18 19 RVTEMPMOD 1
*RSOURCE 8 7 1e-2
*RVTHRES 22 8 1
*RVTEMP 18 19 1
S1A 6 12 13 8 S1AMOD
S1B 13 12 13 8 S1BMOD
S2A 6 15 14 13 S2AMOD
S2B 13 15 14 13 S2BMOD
VBAT 22 19 DC 1
*ESLC 51 50 VALUE=(V(5,51)/ABS(V(5,51)))*(PWR(V(5,51)/(1e-6*19),2.5))
BSLC 51 50 V=(V(5,51)/ABS(V(5,51)))*(PWR(V(5,51)/(1e-6*19),2.5))
.MODEL DBODYMOD D (IS = 1e-12 N=1.02 RS = 7.75e-3 TRS1 = 2.5e-3 TRS2 = 2e-5 CJO = 8.5e-10 TT = 9.6e-6 M = 0.61 XTI=5.5)
.MODEL DBREAKMOD D (RS = 4. 2TRS1 = 1e- 3TRS2 = -8.9e-6)
.MODEL DPLCAPMOD D (CJO = 1.15e-9 IS = 1e-30 N = 10 M = 0.86)
.MODEL MMEDMOD NMOS (VTO = 3.25 KP = 5 IS = 1e-30 N = 10 TOX = 1 L = 1u W = 1u RG = 1.61)
.MODEL MSTROMOD NMOS (VTO = 3.65 KP = 28 IS = 1e-30 N = 10 TOX = 1 L = 1u W = 1u)
.MODEL MWEAKMOD NMOS (VTO = 2.8 KP = 0.05 IS = 1e-30 N = 10 TOX = 1 L = 1u W = 1u RG = 16.1 RS=.1)
.MODEL RBREAKMOD RES (TC1 =1.3e- 3TC2 = 2e-6)
.MODEL RDRAINMOD RES (TC1 = 1e- 2TC2 = 3.7e-5)
.MODEL RSLCMOD RES (TC1 = 4e-3 TC2 = 1e-6)
.MODEL RSOURCEMOD RES (TC1 = 1e-3 TC2 = 1e-6)
.MODEL RVTHRESMOD RES (TC1 = -2e-3 TC2 = -1.3e-5)
.MODEL RVTEMPMOD RES (TC1 = -3e- 3TC2 = 1.9e-6)
.MODEL S1AMOD VSWITCH (RON = 1e-5 ROFF = 0.1 VON = -7.5 VOFF= -.5)
.MODEL S1BMOD VSWITCH (RON = 1e-5 ROFF = 0.1 VON = -.5 VOFF= -7.5)
.MODEL S2AMOD VSWITCH (RON = 1e-5 ROFF = 0.1 VON = -0.1 VOFF= 0.2)
.MODEL S2BMOD VSWITCH (RON = 1e-5 ROFF = 0.1 VON = 0.2 VOFF= -0.1)
.ENDS
* ; IRF630N, Ids=2.5
* ;.param VD=48
* .param Gm0=10
* ;.param ID=2.5
* .param Vth=4
* .param Coss=240p
;step 1:
;Choose :
;Nfets (number of FETs sharing PEP)
.param Nfets=4
.param PEPnet_target=200
.param Rload_net=50
;PEP (peak output power)
;VD (drain bias voltage)
;VDmin (minimum drain voltage of FET, at max amplitude)
.param PEP_target={PEPnet_target/Nfets}
.param VD_target=48
.param VDmin_target=10
;Voutpk=VD_target-VDmin_target
.param Voutpk_target={VD_target-VDmin_target}
;Rload_LV_SE=Voutpk_target^2/(2*PEP_target)
.param Rload_LV_SE_target={Voutpk_target**2/(2*PEP_target)}
;step 1.1
; can use the exact target Rload_LV_SE_target
;.param Rload_LV_SE={Rload_LV_SE_target}
;.param VD=VD_target
;.param PEP=PEP_target
;.param Voutpk=Voutpk_target
;.param VDmin=VDmin_target
; or override it with something realizable with the transformers
; if I override Rload, then PEP will be allowed  to change
.param Rload_LV_SE=12.5
.param PEP={PEP_target*Rload_LV_SE/Rload_LV_SE_target}
; and recalculate other things
.param Voutpk={sqrt(Rload_LV_SE*2*PEP_target)}
.param VD=VD_target
.param VDmin={VD-Voutpk}
;For impedance match on output, set Rout_LV_SE=Rload_LV_SE
.param Rout_LV_SE={Rload_LV_SE}
;step 2:
; choose IDmin (minimum drain current of FET, at max amplitude)
.param IDmin=0.5
; ID=IDmin+Voutpk/Rload_LV_SE
.param ID={IDmin+Voutpk/Rload_LV_SE}
; given Gm0, the Gm of the FET at ID
; and choose Gm, between 0.1Gm0 and 0.5Gm0
;.param Gm0=2
.param Gm=2
; source resistor Rs=(Gm0-Gm)/(Gm0*Gm)
.param Rs={(Gm0-Gm)/(Gm0*Gm)}
;step 3:
; choose gate bias resistor Rgbias
.param Rgbias=100
; choose source resistance
.param Rsource_LV_SE=12.5
; in parallel they make Rsource2
.param Rsource2_LV_SE = {(Rgbias*Rsource_LV_SE)/(Rgbias+Rsource_LV_SE)}
; calculate feedback resistance Rfb
.param Rfb=Rout_LV_SE*(1+Gm*Rsource2_LV_SE)-Rsource2_LV_SE
;step 4:
; choose f0/w0
.param f0=2.7e6
.param w0={2*3.14159*f0}
; calculate blocking caps
; choose cutoff fc=f0/fcratio
.param fcratio_fb=10
.param fcratio_source=5
;.param fc={f0/fcratio}
;.param wc={w0/fcratio}
.param Cfb={fcratio_fb/(w0*Rfb)}
.param Csource={fcratio_source/(w0*Rsource_LV_SE)}
; calculate drain bias inductor to cancel Coss
;.param Coss=100p
.param Ld={1/w0**2/Coss}
; calculate Rin, looking from Rsource
.param Rin_LV_SE={Rgbias*(Rfb+Rload_LV_SE)/(Rgbias*(Gm*Rload_LV_SE+1)+Rfb+Rload_LV_SE)}
.meas PEP PARAM {PEP}
.meas VD PARAM {VD}
.meas VDmin PARAM {VDmin}
.meas Rload_LV_SE_target PARAM {Rload_LV_SE_target}
.meas Rload_LV_SE PARAM {Rload_LV_SE}
.meas IDmin PARAM {IDmin}
.meas ID PARAM {ID}
.meas Gm0 PARAM {Gm0}
.meas Gm PARAM {Gm}
.meas Rs PARAM {Rs}
.meas Rgbias PARAM {Rgbias}
.meas Rsource PARAM {Rsource_LV_SE}
.meas Rfb PARAM {Rfb}
.meas Cfb PARAM {Cfb}
.meas Csource PARAM {Csource}
.meas Rin_LV_SE PARAM {Rin_LV_SE}
.meas VG PARAM {VG}
.meas Coss PARAM {Coss}
.meas Ld PARAM {Ld}
.meas KIN_LP PARAM {KIN_LP}
.meas KIN_LS PARAM {KIN_LS}
.meas KOUT_LP PARAM {KOUT_LP}
.meas KOUT_LS PARAM {KOUT_LS}
.meas Rload_HV_SE PARAM {Rload_HV_SE}
.meas Rsource_HV_SE PARAM {Rsource_HV_SE}
KOUT L5 L6 L7 1
;inductance per each unit winding
.param KOUT_AL=40u
;winding on each side of low voltage center-tapped side
.param KOUT_N_LV=1
.param KOUT_N_HV=4
.param KOUT_LP={KOUT_N_LV**2*KOUT_AL}
.param KOUT_LS={KOUT_N_HV**2*KOUT_AL}
.param Rload_HV_SE={2*Rload_LV_SE*KOUT_LS/(4*KOUT_LP)/(Nfets/2)}
KIN L10 L8 L9 1
;inductance per each unit winding
.param KIN_AL=10u
;winding on each side of low voltage center-tapped side
.param KIN_N_LV=1
.param KIN_N_HV=4
.param KIN_LP={KIN_N_HV**2*KOUT_AL}
.param KIN_LS={KIN_N_LV**2*KOUT_AL}
.param Rsource_HV_SE={2*Rsource_LV_SE*KIN_LP/(4*KIN_LS)/(Nfets/2)}
.backanno
.end